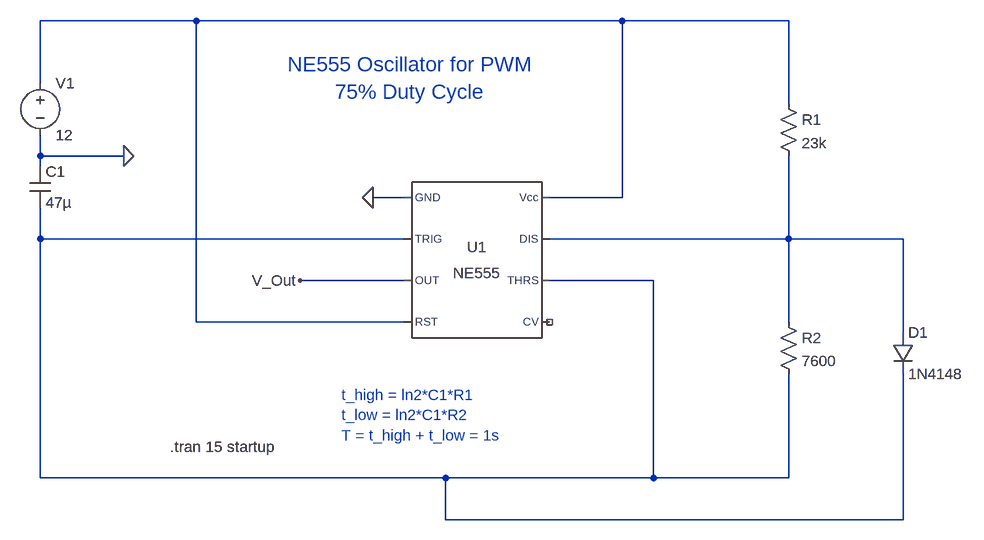
[diagram p0: schematic NE555.asc]
NE555.asc, the LTspice schematic file:
Version 4.1
SHEET 1 1368 804
WIRE 176 32 -64 32
WIRE 832 32 176 32
WIRE 1088 32 832 32
WIRE -64 128 -64 32
WIRE 1088 160 1088 32
WIRE -64 240 -64 208
WIRE 64 240 -64 240
WIRE -64 256 -64 240
WIRE 496 304 448 304
WIRE 832 304 832 32
WIRE 832 304 720 304
WIRE -64 368 -64 320
WIRE 496 368 -64 368
WIRE 1088 368 1088 240
WIRE 1088 368 720 368
WIRE 1264 368 1088 368
WIRE 496 432 336 432
WIRE 880 432 720 432
WIRE 176 496 176 32
WIRE 496 496 176 496
WIRE 1088 496 1088 368
WIRE 1264 512 1264 368
WIRE -64 736 -64 368
WIRE 560 736 -64 736
WIRE 880 736 880 432
WIRE 880 736 560 736
WIRE 1088 736 1088 576
WIRE 1088 736 880 736
WIRE 560 800 560 736
WIRE 1264 800 1264 576
WIRE 1264 800 560 800
FLAG 448 304 0
FLAG 336 432 V_Out
FLAG 64 240 0
SYMBOL Misc\\NE555 608 400 R0
SYMATTR InstName U1
SYMBOL voltage -64 112 R0
WINDOW 123 0 0 Left 0
WINDOW 39 0 0 Left 0
SYMATTR InstName V1
SYMATTR Value 12
SYMBOL cap -80 256 R0
SYMATTR InstName C1
SYMATTR Value 47µ
SYMBOL res 1072 144 R0
SYMATTR InstName R1
SYMATTR Value 23k
SYMBOL res 1072 480 R0
SYMATTR InstName R2
SYMATTR Value 7600
SYMBOL diode 1248 512 R0
SYMATTR InstName D1
SYMATTR Value 1N4148
TEXT 136 688 Left 2 !.tran 15 startup
TEXT 504 120 Center 3 ;NE555 Oscillator for PWM\n75% Duty Cycle
TEXT 400 608 Left 2 ;t_high = ln2*C1*R1\nt_low = ln2*C1*R2\nT = t_high + t_low = 1s

The netlist it stands for:
* NE555.asc
X§U1 0 N002 V_Out N001 NC_01 N002 N003 N001 NE555  ; pins GND TRIG OUT RST CV THRS DIS Vcc
V1 N001 0 12
C1 0 N002 47µ
R1 N001 N003 23k
R2 N003 N002 7600
D1 N003 N002 1N4148
.model D D
.lib standard.dio
.tran 15 startup
* NE555 Oscillator for PWM
* 75% Duty Cycle
* t_high = ln2*C1*R1
* t_low = ln2*C1*R2
* T = t_high + t_low = 1s
.lib NE555.sub
.backanno
.end